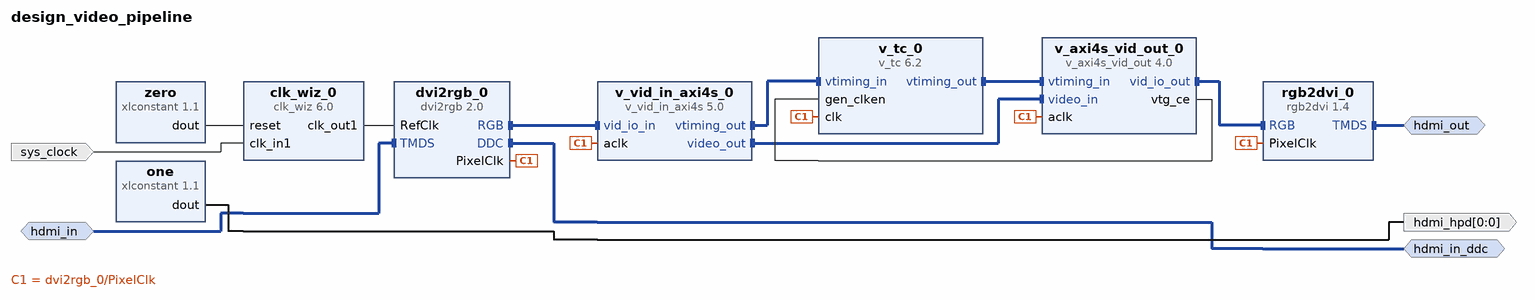
[diagram p0: block diagram of the top level]
# Vivado block design design_video_pipeline, xc7z020clg400-1, Vivado 2022.2
create_bd_design design_video_pipeline

create_bd_intf_port -mode Slave -vlnv digilentinc.com:interface:tmds_rtl:1.0 hdmi_in
create_bd_intf_port -mode Master -vlnv xilinx.com:interface:iic_rtl:1.0 hdmi_in_ddc
create_bd_intf_port -mode Master -vlnv digilentinc.com:interface:tmds_rtl:1.0 hdmi_out
create_bd_port -dir I -type clk sys_clock
set_property -dict {CONFIG.FREQ_HZ 125000000 CONFIG.PHASE 0.0} [get_bd_ports sys_clock]
create_bd_port -dir O -from 0 -to 0 hdmi_hpd

create_bd_cell -type ip -vlnv digilentinc.com:ip:rgb2dvi:1.4 rgb2dvi_0
create_bd_cell -type ip -vlnv digilentinc.com:ip:dvi2rgb:2.0 dvi2rgb_0
create_bd_cell -type ip -vlnv xilinx.com:ip:v_axi4s_vid_out:4.0 v_axi4s_vid_out_0
create_bd_cell -type ip -vlnv xilinx.com:ip:v_vid_in_axi4s:5.0 v_vid_in_axi4s_0
create_bd_cell -type ip -vlnv xilinx.com:ip:v_tc:6.2 v_tc_0
set_property -dict {CONFIG.HAS_AXI4_LITE false CONFIG.auto_generation_mode true} [get_bd_cells v_tc_0]
create_bd_cell -type ip -vlnv xilinx.com:ip:clk_wiz:6.0 clk_wiz_0
set_property -dict [list \
  CONFIG.CLKOUT1_JITTER 109.241 \
  CONFIG.CLKOUT1_REQUESTED_OUT_FREQ 200.000 \
  CONFIG.CLK_IN1_BOARD_INTERFACE sys_clock \
  CONFIG.MMCM_CLKOUT0_DIVIDE_F 5.000 \
  CONFIG.USE_BOARD_FLOW true \
] [get_bd_cells clk_wiz_0]
create_bd_cell -type ip -vlnv xilinx.com:ip:xlconstant:1.1 zero
set_property -dict {CONFIG.CONST_VAL 0} [get_bd_cells zero]
create_bd_cell -type ip -vlnv xilinx.com:ip:xlconstant:1.1 one

# ---- connections ----

connect_bd_intf_net -intf_net TMDS_0_1 [get_bd_intf_ports hdmi_in] [get_bd_intf_pins dvi2rgb_0/TMDS]
connect_bd_intf_net [get_bd_intf_ports hdmi_in_ddc] [get_bd_intf_pins dvi2rgb_0/DDC]
connect_bd_intf_net [get_bd_intf_pins dvi2rgb_0/RGB] [get_bd_intf_pins v_vid_in_axi4s_0/vid_io_in]
connect_bd_intf_net [get_bd_intf_ports hdmi_out] [get_bd_intf_pins rgb2dvi_0/TMDS]
connect_bd_intf_net [get_bd_intf_pins v_axi4s_vid_out_0/vid_io_out] [get_bd_intf_pins rgb2dvi_0/RGB]
connect_bd_intf_net [get_bd_intf_pins v_tc_0/vtiming_out] [get_bd_intf_pins v_axi4s_vid_out_0/vtiming_in]
connect_bd_intf_net [get_bd_intf_pins v_vid_in_axi4s_0/video_out] [get_bd_intf_pins v_axi4s_vid_out_0/video_in]
connect_bd_intf_net [get_bd_intf_pins v_vid_in_axi4s_0/vtiming_out] [get_bd_intf_pins v_tc_0/vtiming_in]
connect_bd_net [get_bd_pins clk_wiz_0/clk_out1] [get_bd_pins dvi2rgb_0/RefClk]
connect_bd_net [get_bd_pins dvi2rgb_0/PixelClk] \
  [get_bd_pins rgb2dvi_0/PixelClk] [get_bd_pins v_vid_in_axi4s_0/aclk] [get_bd_pins v_axi4s_vid_out_0/aclk] \
  [get_bd_pins v_tc_0/clk]
connect_bd_net [get_bd_pins one/dout] [get_bd_ports hdmi_hpd]
connect_bd_net [get_bd_ports sys_clock] [get_bd_pins clk_wiz_0/clk_in1]
connect_bd_net [get_bd_pins v_axi4s_vid_out_0/vtg_ce] [get_bd_pins v_tc_0/gen_clken]
connect_bd_net [get_bd_pins zero/dout] [get_bd_pins clk_wiz_0/reset]

validate_bd_design
save_bd_design
